# EAGLE design #1_routed_1register (EAGLE 9.6.2)
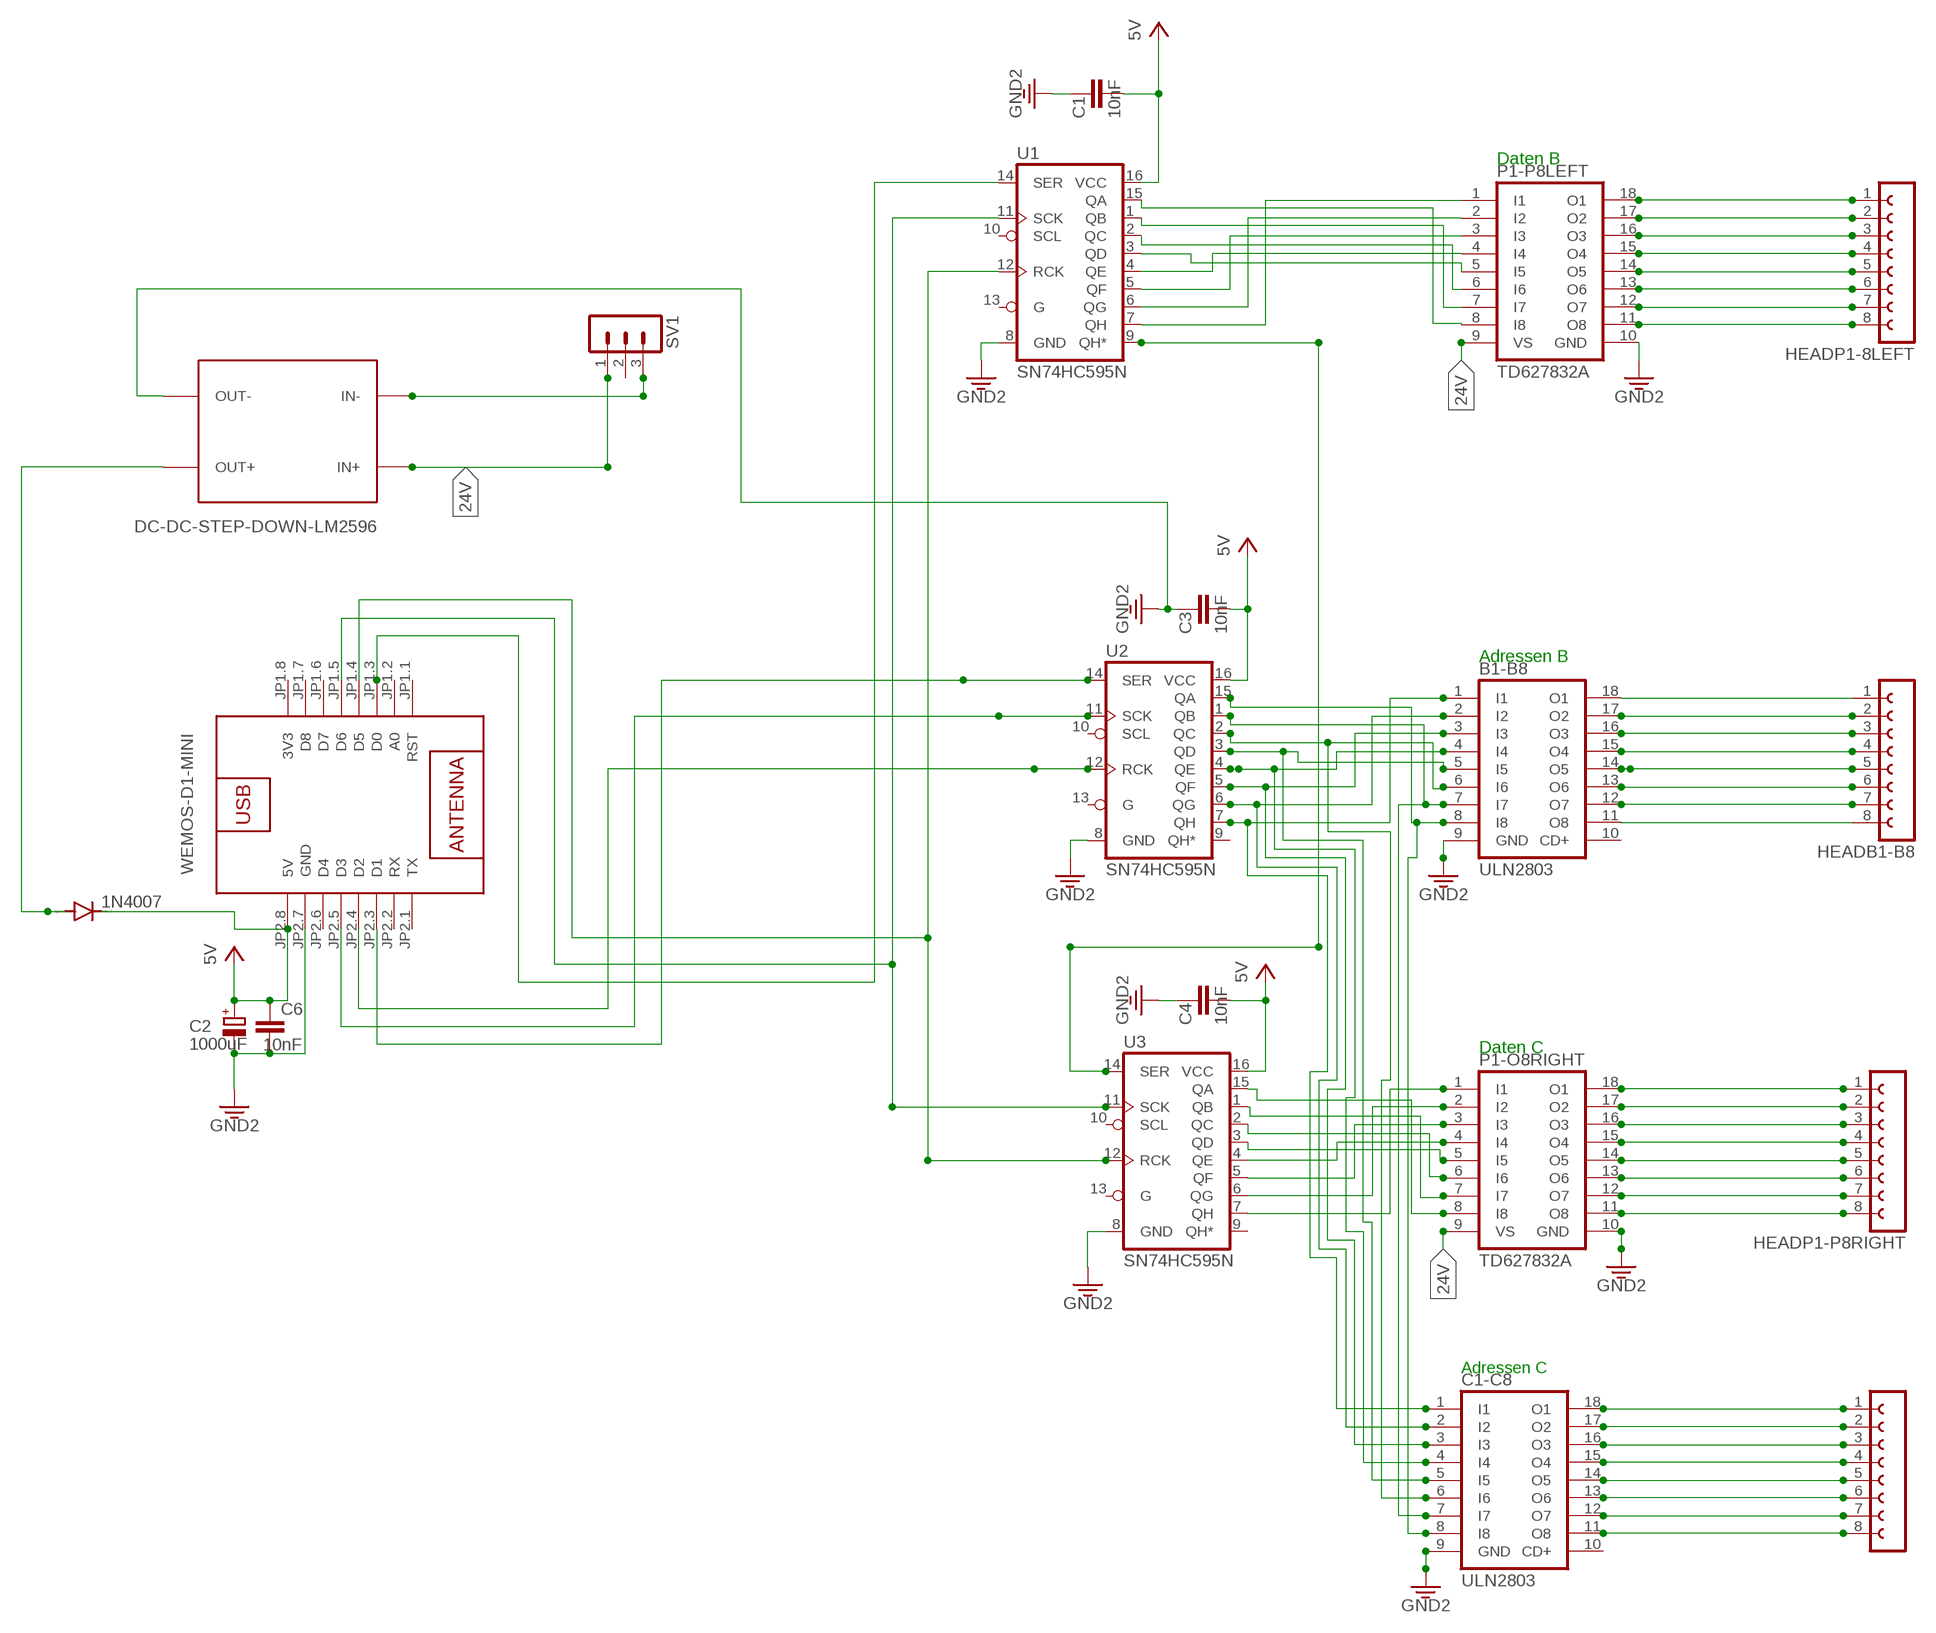
[diagram p0: schematic, sheet 1]

## Parts
1N4007  DIODE-D-2.5  [D-2.5]
B1-B8  ULN2803  ULN2803A  [DIL18]
C1  10nF  C-EU025-025X050  [C025-025X050]
C1-C8  ULN2803  ULN2803A  [DIL18]
C2  1000uF  CPOL-EUE5-10.5  [E5-10,5]
C3  10nF  C-EU025-025X050  [C025-025X050]
C4  10nF  C-EU025-025X050  [C025-025X050]
C6  10nF  C-EU025-025X050  [C025-025X050]
HEADB1-B8  FE08-1  [FE08]
HEADC1-C8  FE08-1  [FE08]
HEADP1-8LEFT  FE08-1  [FE08]
HEADP1-P8RIGHT  FE08-1  [FE08]
P1-O8RIGHT  TD627832A  [DIL18]
P1-P8LEFT  TD627832A  [DIL18]
SV1  MA03-1  [MA03-1]
U1  SN74HC595N  74HC595N  [DIP16]
U2  SN74HC595N  74HC595N  [DIP16]
U3  SN74HC595N  74HC595N  [DIP16]
U$1  WEMOS-D1-MINI  [WEMOS-D1-MINI]
U$2  DC-DC-STEP-DOWN-LM2596  [DC-DC-STEP-DOWN-LM2596]

## Nets
24V: P1-O8RIGHT.9(VS) P1-P8LEFT.9(VS) SV1.1 U$2.IN+
GND: B1-B8.9(GND) C1-C8.9(GND) C1.1 C2.- C3.1 C4.1 C6.2 P1-O8RIGHT.10(GND) P1-P8LEFT.10(GND) U1.8(GND) U2.8(GND) U3.8(GND) U$1.JP2.7(GND) U$2.OUT- ; supply symbol labelled GND2
N$1: B1-B8.7(I7) C1-C8.7(I7) U2.1(QB)
N$2: B1-B8.2(I2) C1-C8.2(I2) U2.6(QG)
N$3: B1-B8.3(I3) C1-C8.3(I3) U2.5(QF)
N$4: B1-B8.4(I4) C1-C8.4(I4) U2.4(QE)
N$5: B1-B8.5(I5) C1-C8.5(I5) U2.3(QD)
N$6: B1-B8.6(I6) C1-C8.6(I6) U2.2(QC)
N$7: B1-B8.1(I1) C1-C8.1(I1) U2.7(QH)
N$8: B1-B8.8(I8) C1-C8.8(I8) U2.15(QA)
N$9: HEADP1-8LEFT.2 P1-P8LEFT.17(O2)
N$10: HEADP1-8LEFT.3 P1-P8LEFT.16(O3)
N$11: HEADP1-8LEFT.4 P1-P8LEFT.15(O4)
N$12: HEADP1-8LEFT.5 P1-P8LEFT.14(O5)
N$13: HEADP1-8LEFT.6 P1-P8LEFT.13(O6)
N$14: HEADP1-8LEFT.7 P1-P8LEFT.12(O7)
N$15: HEADP1-8LEFT.8 P1-P8LEFT.11(O8)
N$16: B1-B8.18(O1) HEADB1-B8.1
N$17: B1-B8.17(O2) HEADB1-B8.2
N$18: B1-B8.16(O3) HEADB1-B8.3
N$19: B1-B8.15(O4) HEADB1-B8.4
N$20: HEADP1-8LEFT.1 P1-P8LEFT.18(O1)
N$21: B1-B8.14(O5) HEADB1-B8.5
N$22: B1-B8.13(O6) HEADB1-B8.6
N$23: B1-B8.12(O7) HEADB1-B8.7
N$24: B1-B8.11(O8) HEADB1-B8.8
N$25: P1-P8LEFT.1(I1) U1.7(QH)
N$26: HEADP1-P8RIGHT.1 P1-O8RIGHT.18(O1)
N$27: P1-P8LEFT.2(I2) U1.6(QG)
N$28: HEADP1-P8RIGHT.3 P1-O8RIGHT.16(O3)
N$29: P1-P8LEFT.3(I3) U1.5(QF)
N$30: HEADP1-P8RIGHT.2 P1-O8RIGHT.17(O2)
N$31: P1-P8LEFT.4(I4) U1.4(QE)
N$32: P1-P8LEFT.5(I5) U1.3(QD)
N$33: HEADP1-P8RIGHT.5 P1-O8RIGHT.14(O5)
N$34: U1.14(SER) U$1.JP1.3(D0)
N$35: HEADP1-P8RIGHT.6 P1-O8RIGHT.13(O6)
N$37: U2.14(SER) U$1.JP2.3(D1)
N$39: HEADP1-P8RIGHT.4 P1-O8RIGHT.15(O4)
N$40: HEADP1-P8RIGHT.7 P1-O8RIGHT.12(O7)
N$41: P1-P8LEFT.6(I6) U1.2(QC)
N$42: P1-P8LEFT.7(I7) U1.1(QB)
N$43: P1-P8LEFT.8(I8) U1.15(QA)
N$44: P1-O8RIGHT.2(I2) U3.6(QG)
N$45: P1-O8RIGHT.3(I3) U3.5(QF)
N$46: P1-O8RIGHT.4(I4) U3.4(QE)
N$47: P1-O8RIGHT.5(I5) U3.3(QD)
N$48: P1-O8RIGHT.6(I6) U3.2(QC)
N$49: HEADP1-P8RIGHT.8 P1-O8RIGHT.11(O8)
N$50: C1-C8.18(O1) HEADC1-C8.1
N$51: C1-C8.17(O2) HEADC1-C8.2
N$52: C1-C8.16(O3) HEADC1-C8.3
N$53: C1-C8.15(O4) HEADC1-C8.4
N$54: C1-C8.14(O5) HEADC1-C8.5
N$55: P1-O8RIGHT.7(I7) U3.1(QB)
N$56: P1-O8RIGHT.8(I8) U3.15(QA)
N$57: C1-C8.13(O6) HEADC1-C8.6
N$58: C1-C8.12(O7) HEADC1-C8.7
N$59: C1-C8.11(O8) HEADC1-C8.8
N$60: U2.12(RCK) U$1.JP2.4(D2)
N$61: SV1.3 U$2.IN-
N$69: 1N4007.A U$2.OUT+
N$72: P1-O8RIGHT.1(I1) U3.7(QH)
N$74: U1.12(RCK) U3.12(RCK) U$1.JP1.4(D5)
N$76: U1.11(SCK) U3.11(SCK) U$1.JP1.5(D6)
N$80: U2.11(SCK) U$1.JP2.5(D3)
N$92: U1.9(QH*) U3.14(SER)
VCC: 1N4007.C C1.2 C2.+ C3.2 C4.2 C6.1 U1.16(VCC) U2.16(VCC) U3.16(VCC) U$1.JP2.8(5V) ; supply symbol labelled 5V
Unconnected: B1-B8.10(CD+) C1-C8.10(CD+) SV1.2 U1.10(SCL) U1.13(G) U2.9(QH*) U2.10(SCL) U2.13(G) U3.9(QH*) U3.10(SCL) U3.13(G) U$1.JP1.1(RST) U$1.JP1.2(A0) U$1.JP1.6(D7) U$1.JP1.7(D8) U$1.JP2.1(TX) U$1.JP2.2(RX) U$1.JP2.6(D4)

## Notes on the sheet
- Daten B
- Adressen B
- Daten C
- Adressen C

## Power pins joined to a net without a drawn wire
3V3: U$1.JP1.8(3V3)

## Library data of the parts
1N4007 = diode:DIODE-: DIODE
B1-B8 C1-C8 = uln-udn:ULN2803A: DRIVER ARRAY
C1 C3 C4 C6 = resistor:C-EU: CAPACITOR, European symbol
C2 = resistor:CPOL-EU: POLARIZED CAPACITOR, European symbol
HEADB1-B8 HEADC1-C8 HEADP1-8LEFT HEADP1-P8RIGHT = con-lsta:FE08-1: FEMALE HEADER; OC_FARNELL: unknown; OC_NEWARK: unknown
P1-O8RIGHT P1-P8LEFT = td62083-dil:TD62783: DRIVER ARRAY Source: Allegro Microsystems Inc. / UDN2981-UDN2984.pdf
SV1 = con-lstb:MA03-1: PIN HEADER; OC_FARNELL: unknown; OC_NEWARK: unknown
U1-U3 = SparkFun-IC-Logic:74*595: 8-Bit Shift Register (Serial to Parallel) Datasheet <http://cdn.sparkfun.com/datasheets/BreakoutBoards/MM74HC595.pdf> SparkFun Products SparkFun Shift Register Breakout - 74HC595 <https://www.sparkfun.com/products/10680> (BOB-10680); PROD_ID: IC-13123
U$1 = diy-modules:WEMOS-D1-MINI: WEMOS D1 mini: Mini Wi-Fi Board based on ESP-8266 device More details can be found here: https://www.wemos.cc/product/d1-mini.html Click here to find device on ebay.com <http://www.ebay.com/sch/wemos+d1+mini+nodemcu>
U$2 = diy-modules_lm2596:DC-DC-STEP-DOWN-LM2596: DC/DC Step-Down Regulator based on LM2596-ADJ chip LM2596 datasheet available here: http://www.ti.com/lit/ds/symlink/lm2596.pdf Click here to find device on ebay.com <http://www.ebay.com/sch/lm2596+power+regulator>

## Board
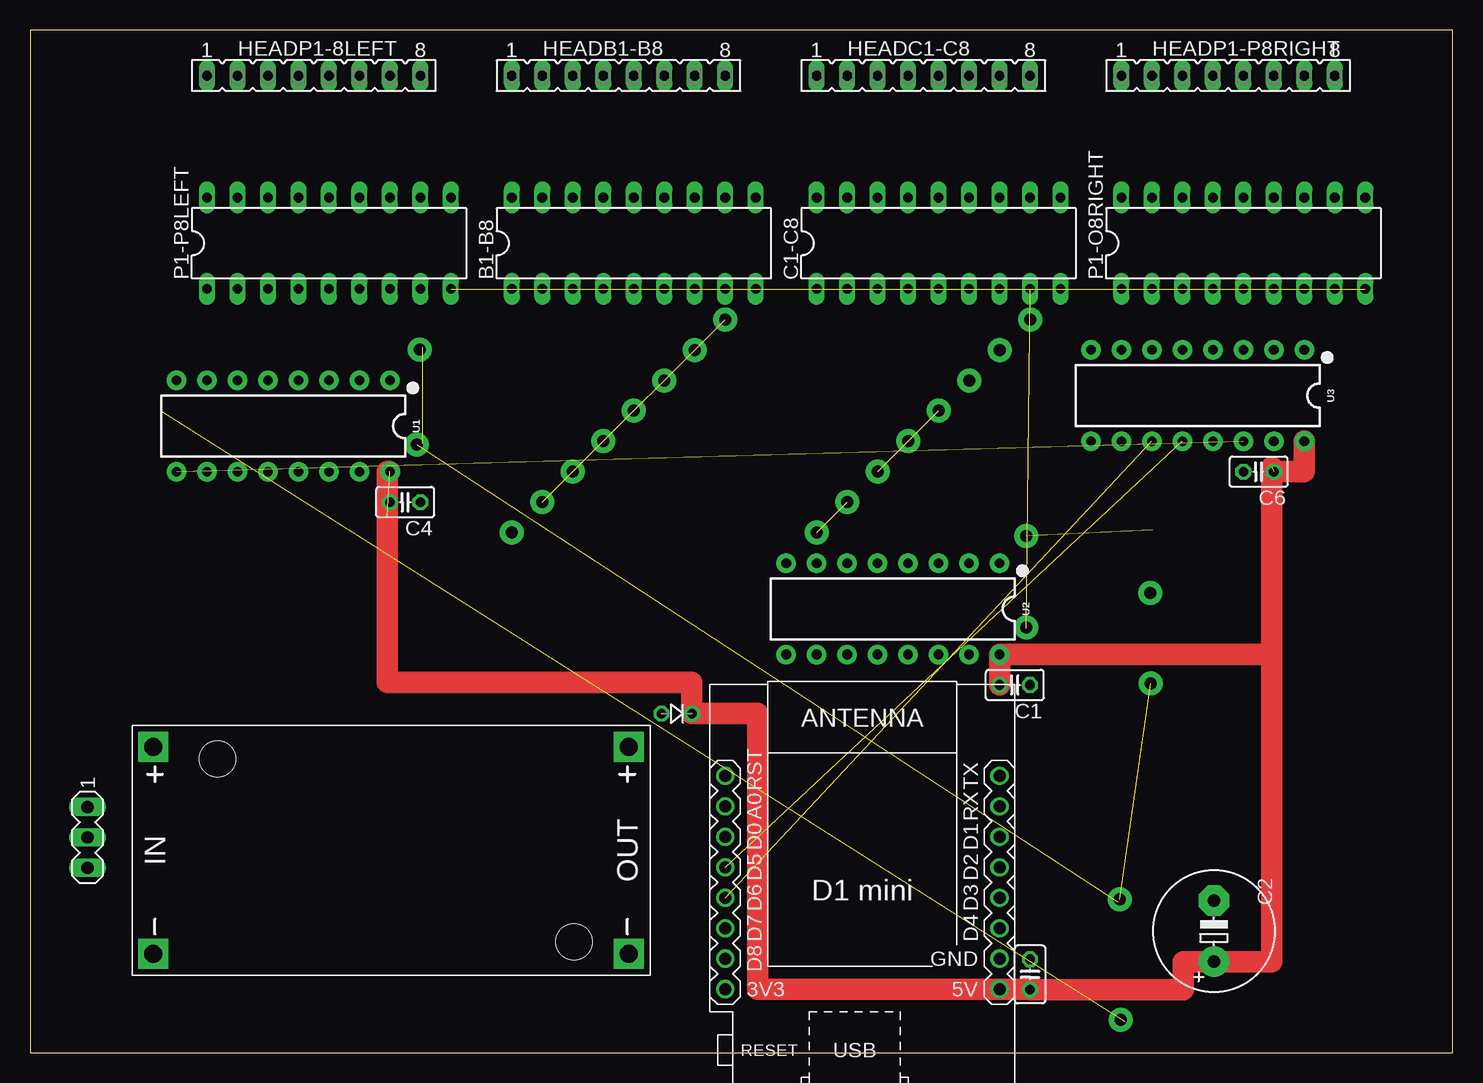
[diagram p1: board, top side]
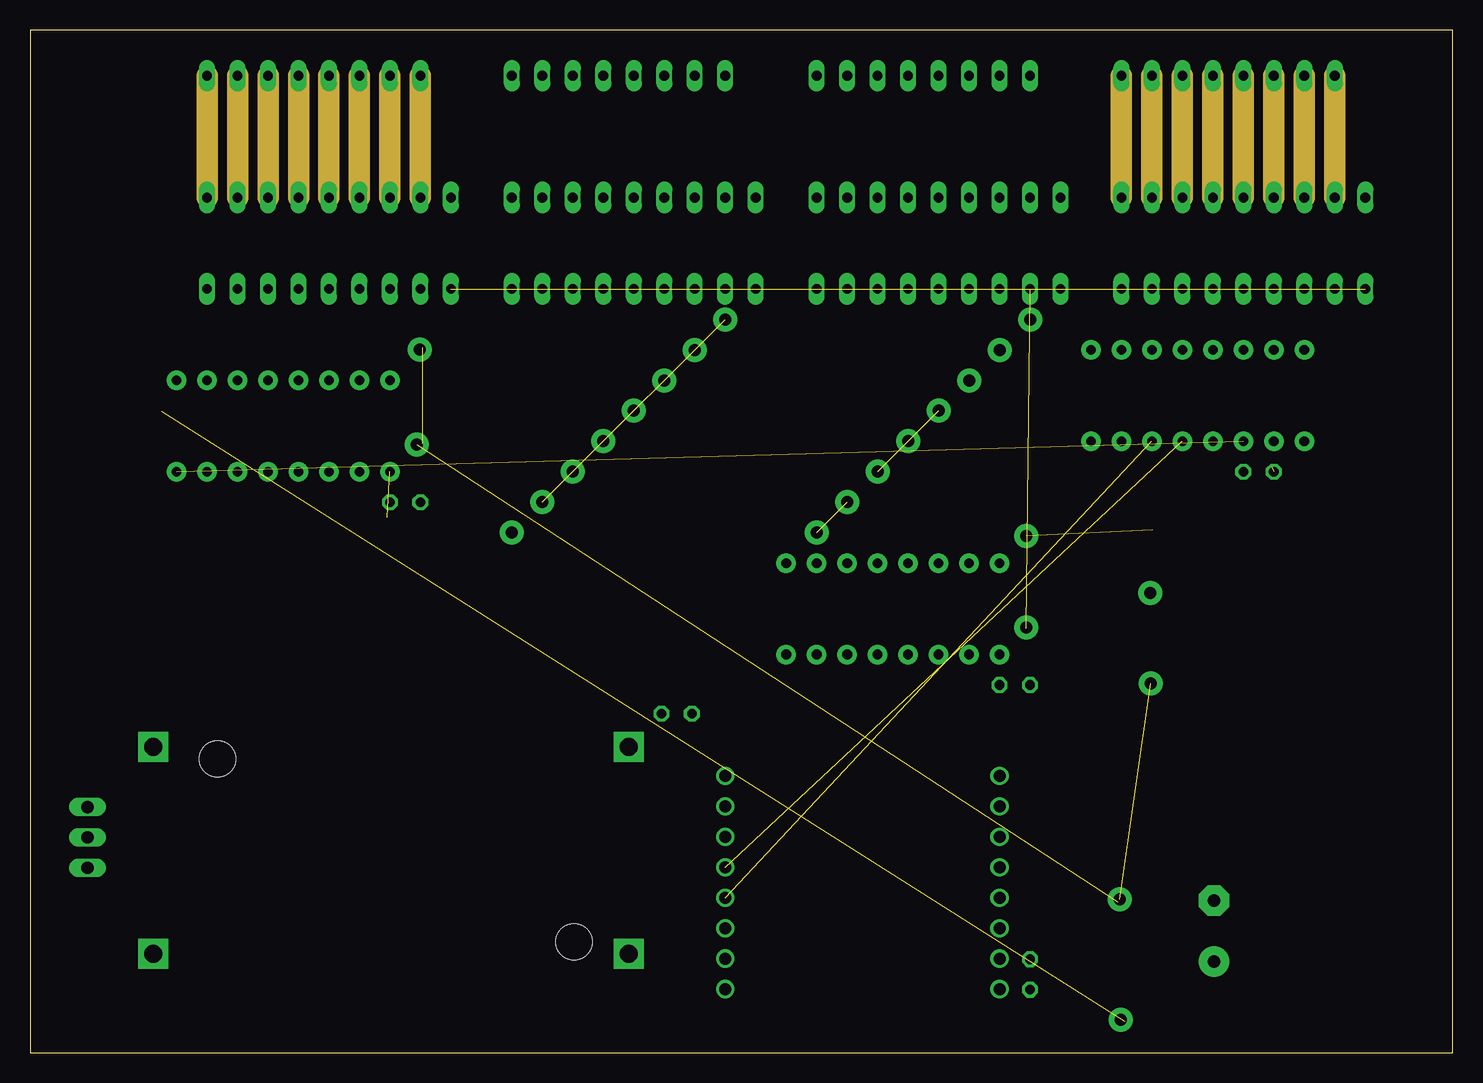
[diagram p2: board, inner layer Data]
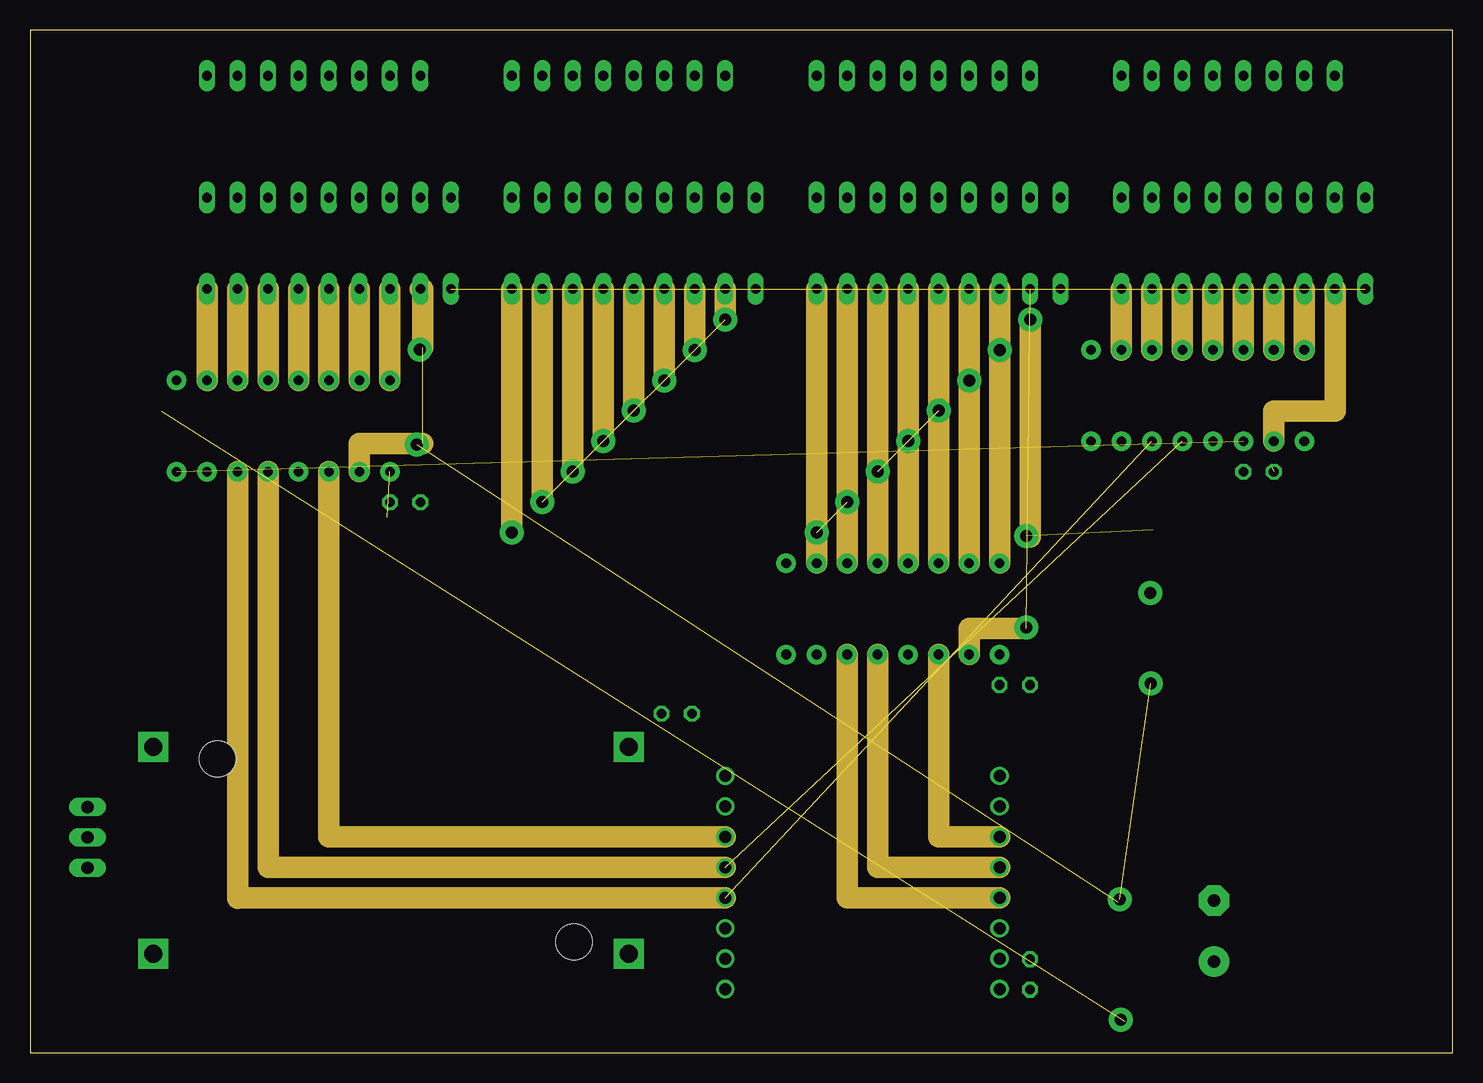
[diagram p3: board, inner layer Logic]
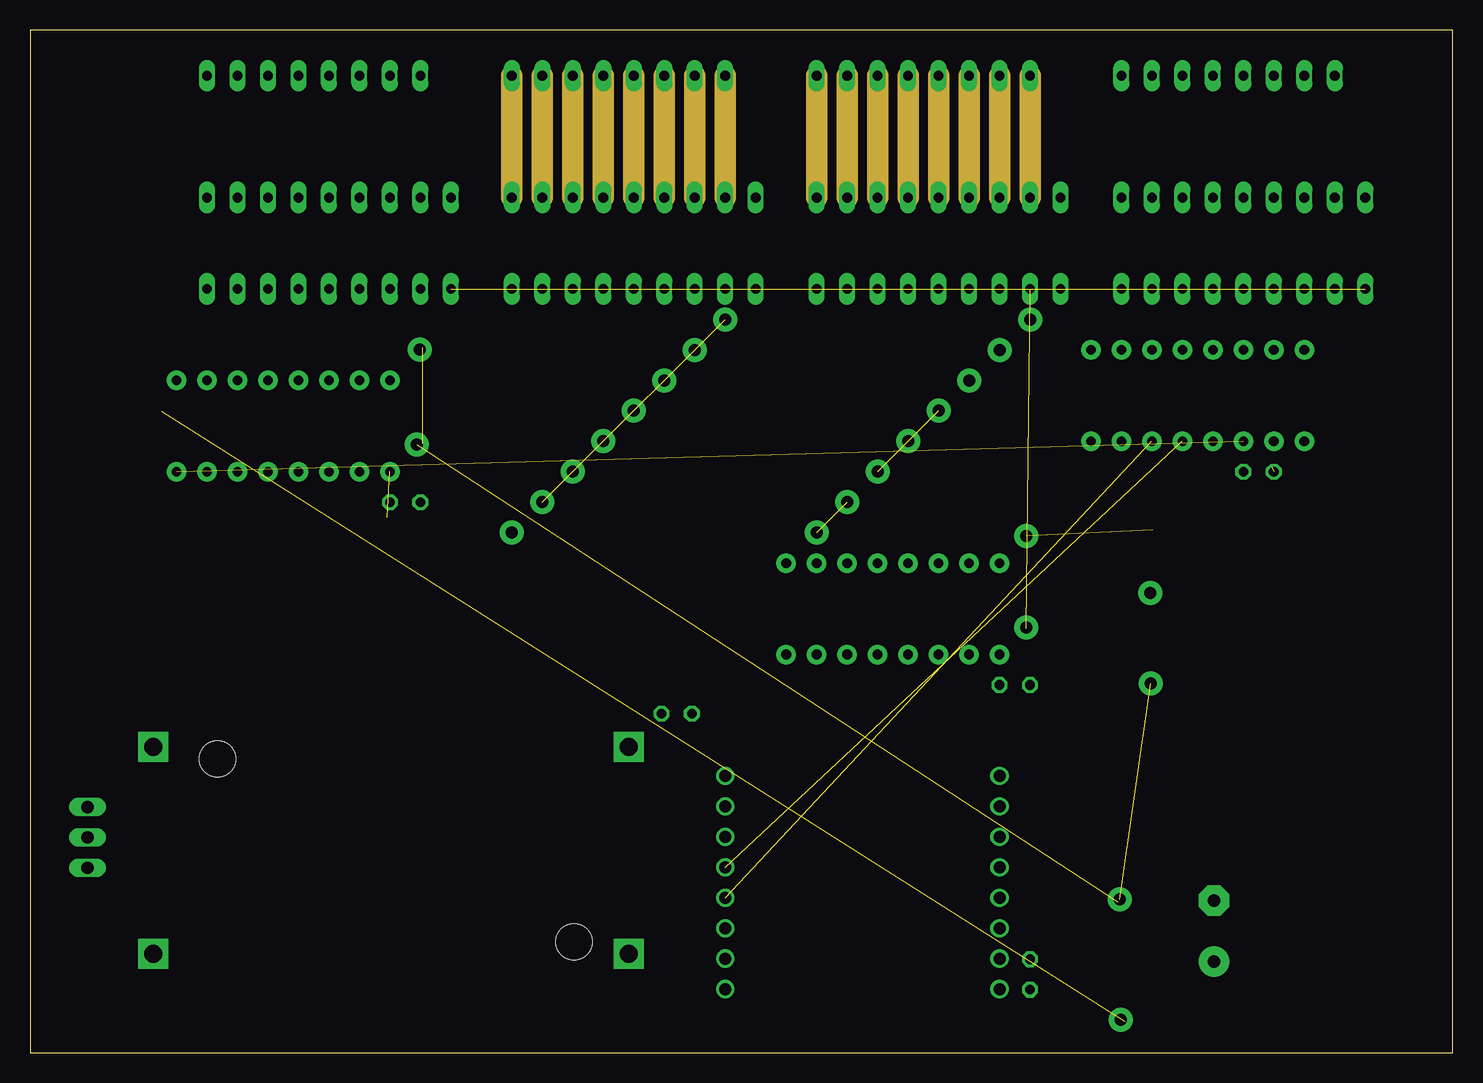
[diagram p4: board, inner layer Adress]
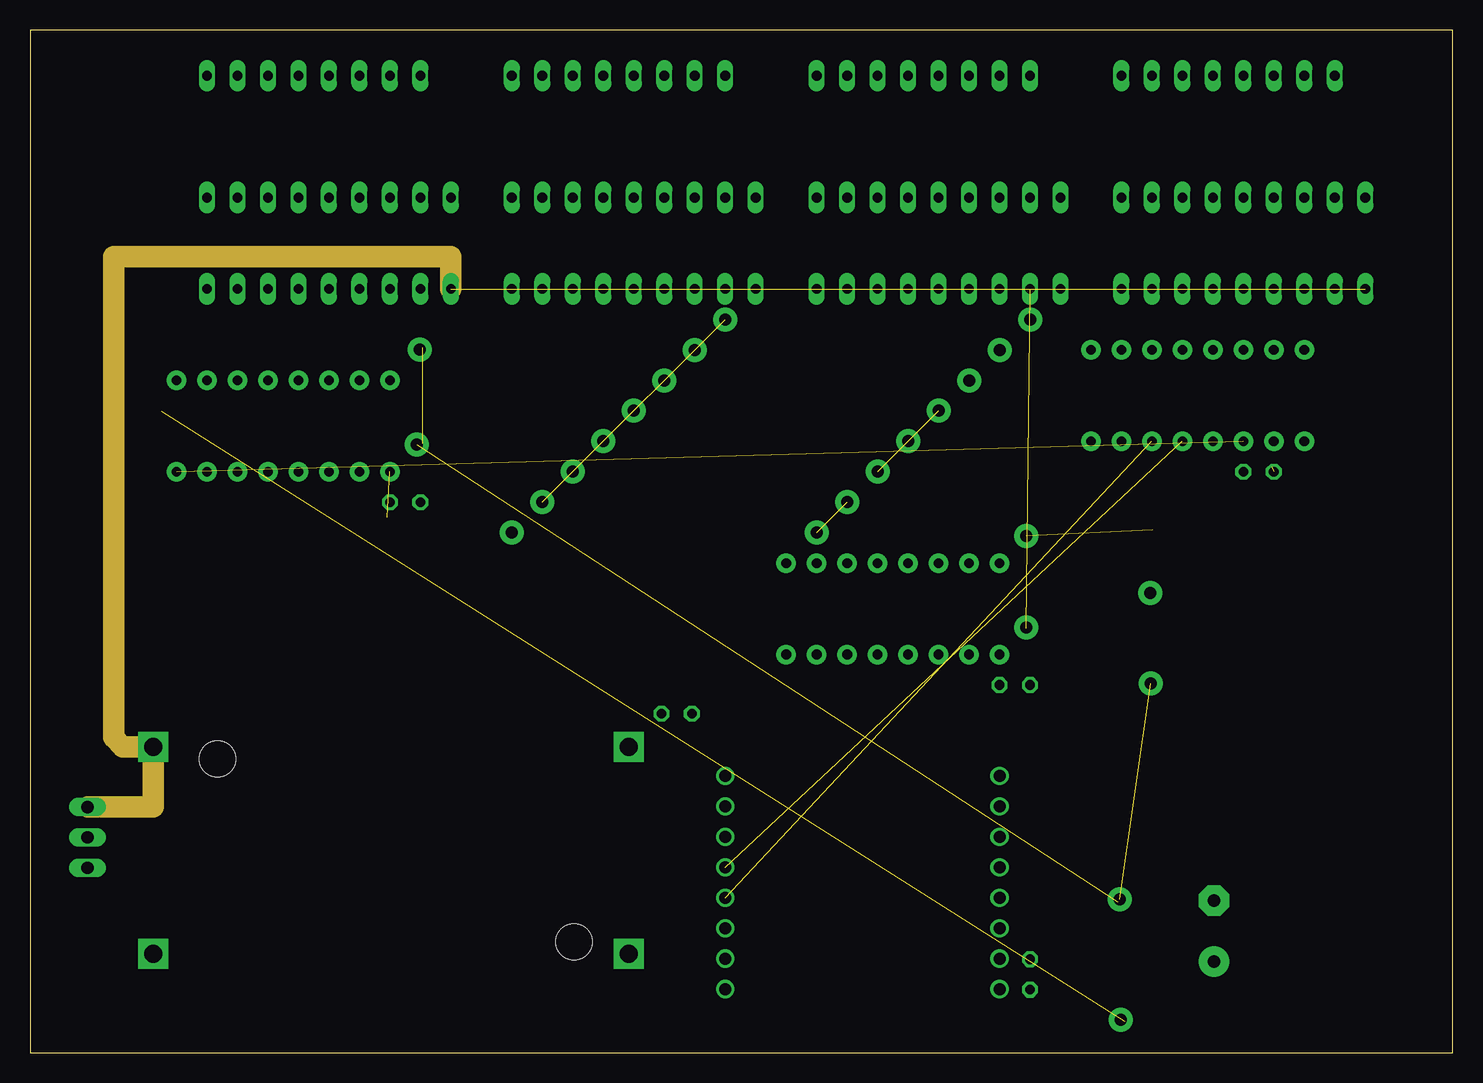
[diagram p5: board, inner layer 18V]
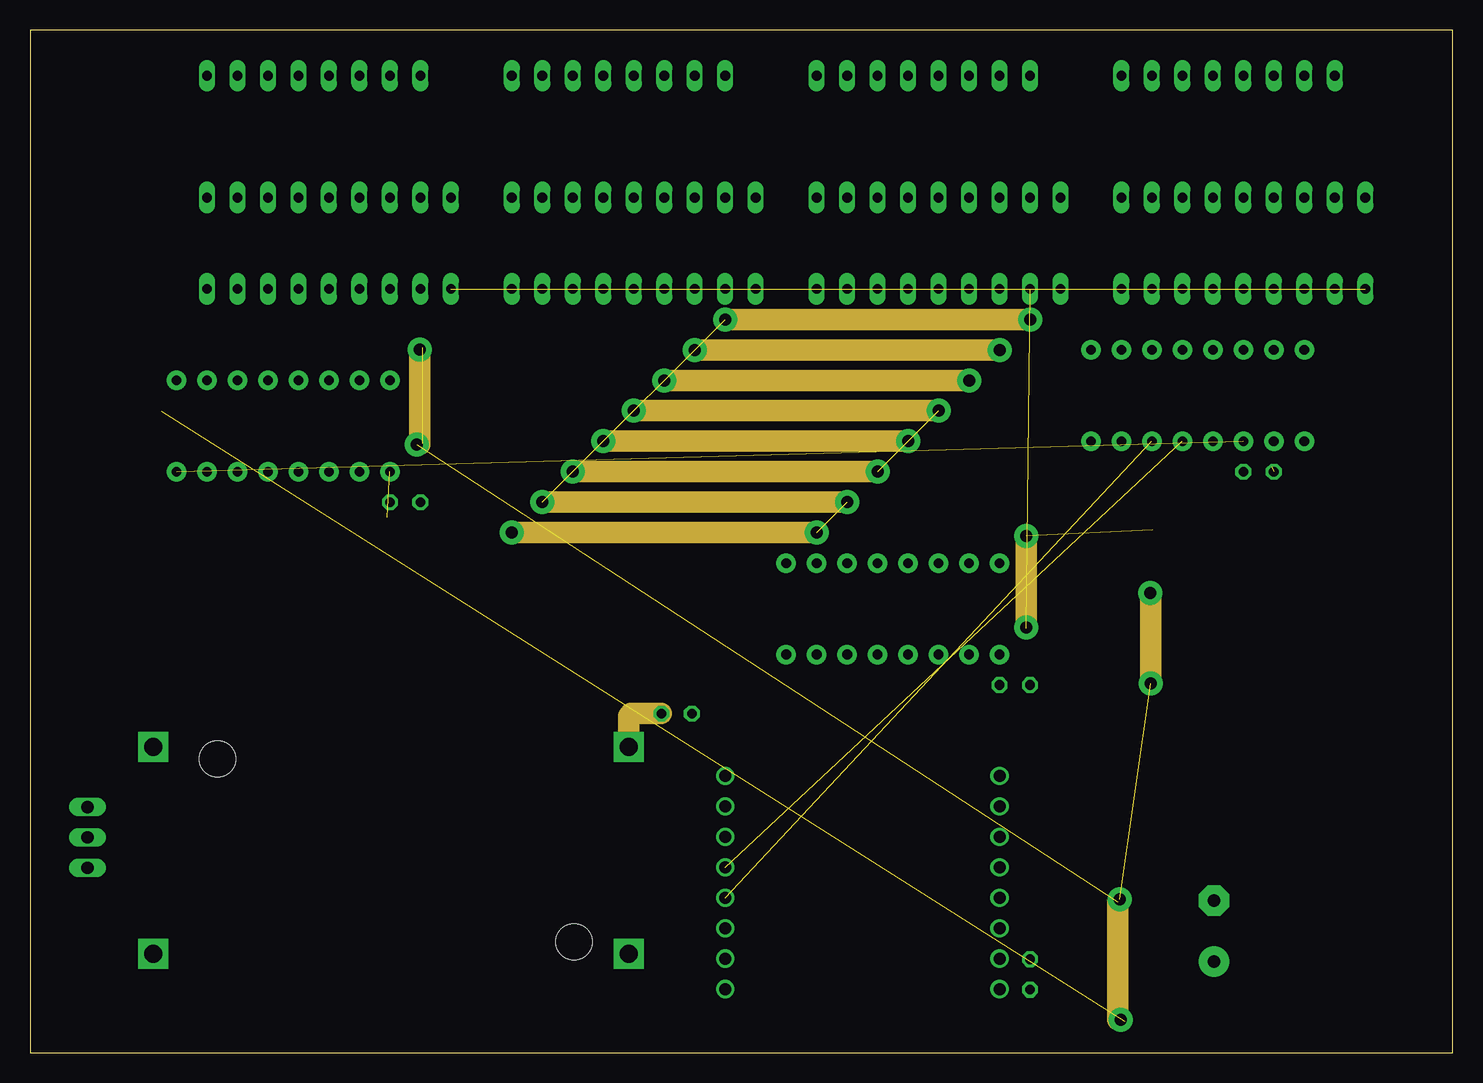
[diagram p6: board, inner layer Cable]
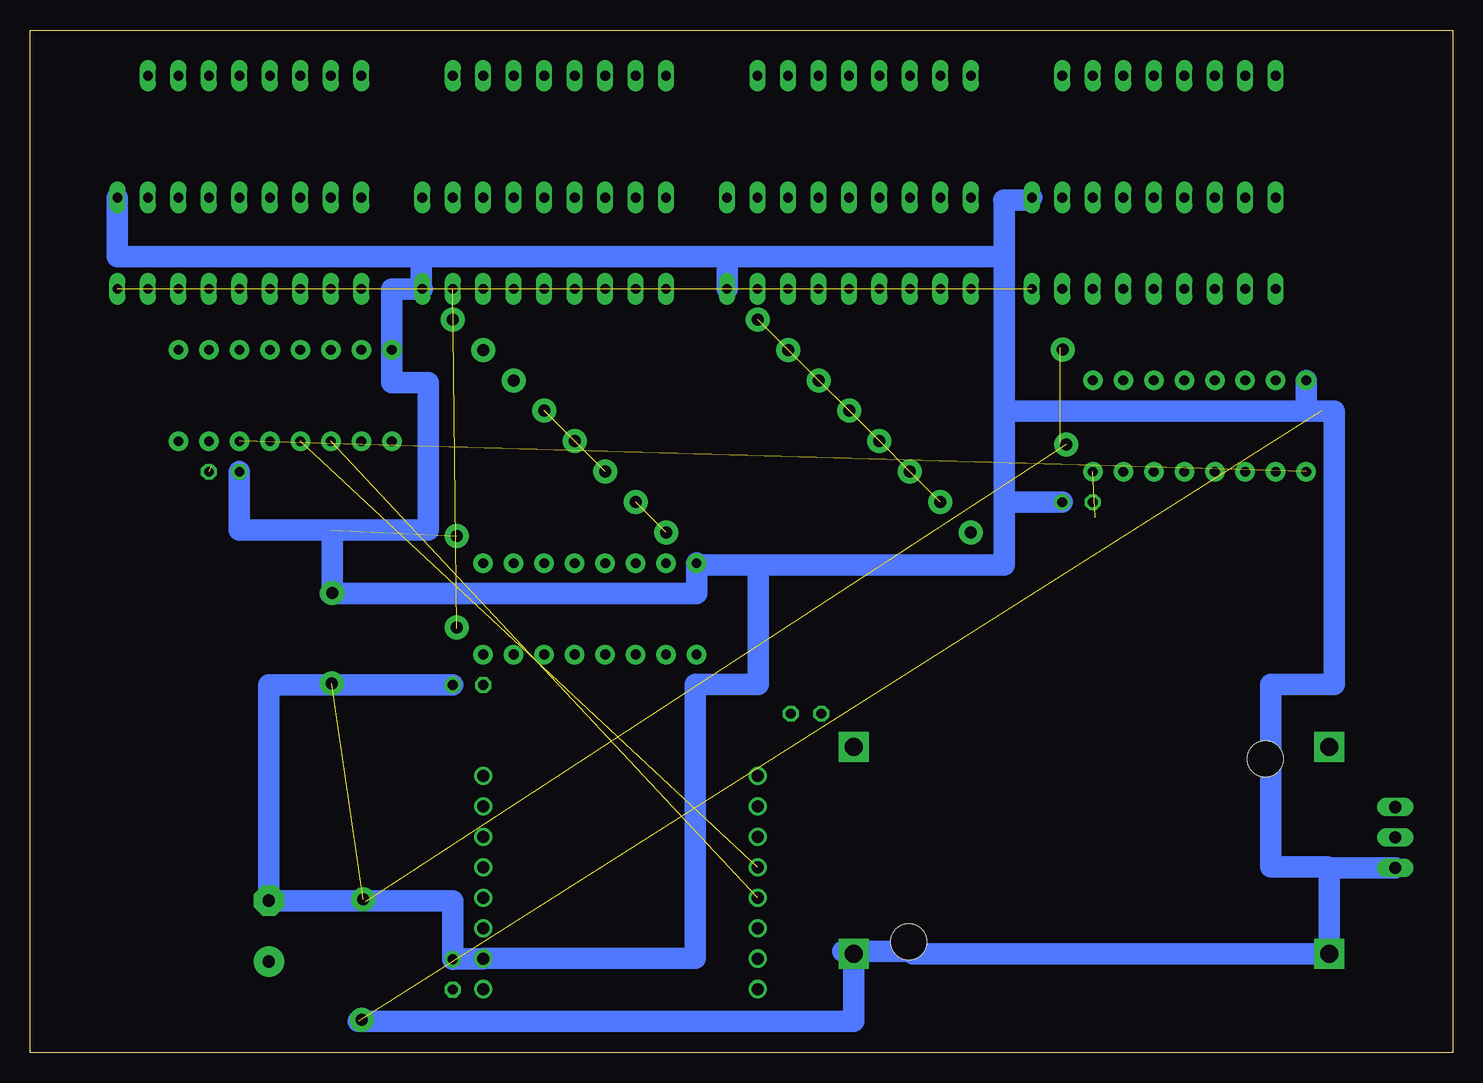
[diagram p7: board, bottom side, seen from below]

Size 118.56 x 85.27 mm. Coordinates in mm from the lower left corner, seen from the top.
Outline: 0,85.27 0,0 118.56,0 118.56,85.27 0,85.27
Copper layers (1+2*3+4*13+14*15+16): 5V 0.035mm / dielectric 1.5mm / Data 0.035mm / dielectric 0.15mm / Logic 0.035mm / dielectric 0.2mm / Adress 0.035mm / dielectric 0.15mm / Route13 0.035mm / dielectric 0.2mm / 18V 0.035mm / dielectric 0.15mm / Cable 0.035mm / dielectric 0.2mm / GND 0.035mm
Design rules "default *": minimum track width 6mil, minimum drill 0.35mm, track to track 6mil, track to pad 6mil, pad to pad 6mil, via to via 6mil, smd to smd 6mil, copper to edge 40mil, drill to drill 6mil, minimum pad ring 10mil, minimum via ring 8mil, stop-mask expansion 4mil, vias tented up to drill 0mil, thermal gap 10mil

### Footprints (pad centres in the part's own frame; a part is rotated, then mirrored left to right if it is on the bottom)
D-2.5 = drill 0.813 octagon: A 1.27,0; C -1.27,0
DIL18 = drill 0.813 long: 1 -10.16,-3.81; 2 -7.62,-3.81; 3 -5.08,-3.81; 4 -2.54,-3.81; 5 0,-3.81; 6 2.54,-3.81; 7 5.08,-3.81; 8 7.62,-3.81; 9 10.16,-3.81; 10 10.16,3.81; 11 7.62,3.81; 12 5.08,3.81; 13 2.54,3.81; 14 0,3.81; 15 -2.54,3.81; 16 -5.08,3.81; 17 -7.62,3.81; 18 -10.16,3.81
C025-025X050 = drill 0.813 octagon: 1 -1.27,0; 2 1.27,0
E5-10,5 = drill 1.016 pad 2.54: + -2.54,0 | drill 1.016 pad 2.54 octagon: - 2.54,0
FE08 = drill 0.813 long: 1 -8.89,0; 2 -6.35,0; 3 -3.81,0; 4 -1.27,0; 5 1.27,0; 6 3.81,0; 7 6.35,0; 8 8.89,0
MA03-1 = drill 1.016 long: 1 -2.54,0; 2 0,0; 3 2.54,0
DIP16 = drill 0.813 pad 1.626: 1 -8.89,-3.81; 2 -6.35,-3.81; 3 -3.81,-3.81; 4 -1.27,-3.81; 5 1.27,-3.81; 6 3.81,-3.81; 7 6.35,-3.81; 8 8.89,-3.81; 9 8.89,3.81; 10 6.35,3.81; 11 3.81,3.81; 12 1.27,3.81; 13 -1.27,3.81; 14 -3.81,3.81; 15 -6.35,3.81; 16 -8.89,3.81
WEMOS-D1-MINI = drill 1: JP1.1 -11.43,9.525; JP1.2 -11.43,6.985; JP1.3 -11.43,4.445; JP1.4 -11.43,1.905; JP1.5 -11.43,-0.635; JP1.6 -11.43,-3.175; JP1.7 -11.43,-5.715; JP1.8 -11.43,-8.255; JP2.1 11.43,9.525; JP2.2 11.43,6.985; JP2.3 11.43,4.445; JP2.4 11.43,1.905; JP2.5 11.43,-0.635; JP2.6 11.43,-3.175; JP2.7 11.43,-5.715; JP2.8 11.43,-8.255
DC-DC-STEP-DOWN-LM2596 = drill 1.5 pad 2.5 square: IN+ -19.812,8.636; IN- -19.812,-8.636; OUT+ 19.812,8.636; OUT- 19.812,-8.636 | hole 3: -14.478,7.62; 15.24,-7.62

### Placement (x,y rotation side)
1N4007  53.89,28.27 180 top
B1-B8  50.31,67.49 0 top
C1  82.06,30.66 180 top
C1-C8  75.72,67.49 0 top
C2  98.66,10.14 90 top
C3  83.34,6.53 270 top
C4  31.27,45.9 180 top
C6  102.39,48.44 180 top
HEADB1-B8  49.05,81.46 0 top
HEADC1-C8  74.45,81.46 0 top
HEADP1-8LEFT  23.65,81.46 0 top
HEADP1-P8RIGHT  99.84,81.46 0 top
P1-O8RIGHT  101.12,67.49 0 top
P1-P8LEFT  24.91,67.49 0 top
SV1  4.8,17.95 270 top
U1  21.11,52.25 180 top
U2  71.91,37.01 180 top
U3  97.31,54.79 180 top
U$1  69.36,13.56 0 top
U$2  30.09,16.88 0 top

### Tracks (layer width: path | path; a pad name or v marks a point on that pad's centre or on a via)
24V  (1 unrouted)
  18V 1.8: SV1.1 10.28,20.48 U$2.IN+ 7.74,25.51 6.97,26.28 6.97,66.39 35.08,66.39 P1-P8LEFT.9
GND  (1 unrouted)
  GND 1.8: P1-P8LEFT.10 35.31,71.06 37.39,71.06 | 37.41,71.06 37.39,71.06 | 37.39,66.39 60.48,66.39 | B1-B8.9 60.48,66.39 | 60.48,66.39 85.94,66.39 | 85.94,66.39 85.94,63.68 C1-C8.9 88.42,63.68 U3.8 88.42,55.86 85.36,55.86 85.36,43.57 101.12,43.57 C6.2 | P1-O8RIGHT.10 111.28,66.39 85.94,66.39 | C1.1 98.66,30.66 C2.- 83.34,12.68 C3.1 83.34,7.85 U$1.JP2.7 80.8,7.88 63.13,7.88 63.13,30.7 57.87,30.7 57.87,40.65 | 37.39,53.52 37.39,66.39 | 37.39,66.39 37.39,71.06 | 12.22,53.52 37.39,53.52 | U1.8 12.22,53.52 | 93.55,38.3 63.02,38.3 U2.8 63.02,40.65 57.87,40.65 | 37.39,53.52 37.39,45.9 | 37.39,45.9 37.39,40.65 57.87,40.65 | C4.1 37.39,45.9 | 12.22,53.52 10.95,53.52 9.9,53.52 9.9,30.7 15.16,30.7 15.16,15.49 10.48,15.49 | U$2.OUT- 49.91,2.62 91.21,2.62
N$1  (via drill 1 pad 2)  (1 unrouted)
  Logic 1.8: U2.1 v80.8,58.6 C1-C8.7 | B1-B8.7 55.39,58.6
  Cable 1.8: v80.8,58.6 55.39,58.6
N$2  (1 unrouted)
  Logic 1.8: U2.6 C1-C8.2 | B1-B8.2 42.7,45.9
N$3  (1 unrouted)
  Logic 1.8: U2.5 C1-C8.3 | B1-B8.3 45.23,48.44
N$4  (1 unrouted)
  Logic 1.8: U2.4 C1-C8.4 | B1-B8.4 47.78,50.98
N$5  (1 unrouted)
  Logic 1.8: U2.3 C1-C8.5 | B1-B8.5 50.31,53.52
N$6  (via drill 1 pad 2)  (1 unrouted)
  Logic 1.8: U2.2 v78.25,56.06 C1-C8.6 | B1-B8.6 52.86,56.06
  Cable 1.8: v78.25,56.06 52.86,56.06
N$7  (1 unrouted)
  Logic 1.8: U2.7 C1-C8.1 | B1-B8.1 40.16,43.36
N$8  (2 unrouted)
  Logic 1.8: U2.15 78.25,35.38 83.02,35.38
N$9
  Data 1.8: P1-P8LEFT.17 HEADP1-8LEFT.2
N$10
  Data 1.8: P1-P8LEFT.16 HEADP1-8LEFT.3
N$11
  Data 1.8: P1-P8LEFT.15 HEADP1-8LEFT.4
N$12
  Data 1.8: P1-P8LEFT.14 HEADP1-8LEFT.5
N$13
  Data 1.8: P1-P8LEFT.13 HEADP1-8LEFT.6
N$14
  Data 1.8: HEADP1-8LEFT.7 P1-P8LEFT.12
N$15
  Data 1.8: P1-P8LEFT.11 HEADP1-8LEFT.8
N$16
  Adress 1.8: B1-B8.18 HEADB1-B8.1
N$17
  Adress 1.8: B1-B8.17 HEADB1-B8.2
N$18
  Adress 1.8: B1-B8.16 HEADB1-B8.3
N$19
  Adress 1.8: B1-B8.15 HEADB1-B8.4
N$20
  Data 1.8: P1-P8LEFT.18 HEADP1-8LEFT.1
N$21
  Adress 1.8: B1-B8.14 HEADB1-B8.5
N$22
  Adress 1.8: B1-B8.13 HEADB1-B8.6
N$23
  Adress 1.8: B1-B8.12 HEADB1-B8.7
N$24
  Adress 1.8: B1-B8.11 HEADB1-B8.8
N$25
  Logic 1.8: P1-P8LEFT.1 U1.7
N$26
  Data 1.8: P1-O8RIGHT.18 HEADP1-P8RIGHT.1
N$27
  Logic 1.8: U1.6 P1-P8LEFT.2
N$28
  Data 1.8: P1-O8RIGHT.16 HEADP1-P8RIGHT.3
N$29
  Logic 1.8: P1-P8LEFT.3 U1.5
N$30
  Data 1.8: P1-O8RIGHT.17 HEADP1-P8RIGHT.2
N$31
  Logic 1.8: P1-P8LEFT.4 U1.4
N$32
  Logic 1.8: U1.3 P1-P8LEFT.5
N$33
  Data 1.8: P1-O8RIGHT.14 HEADP1-P8RIGHT.5
N$34
  Logic 1.8: U1.14 24.91,18.01 U$1.JP1.3
N$35
  Data 1.8: P1-O8RIGHT.13 HEADP1-P8RIGHT.6
N$36  (via drill 1 pad 2)  (2 unrouted)
  Cable 1.8: v93.42,30.77 93.42,38.32 v93.37,38.32
  GND 1.8: v93.37,38.32 93.37,43.57 93.55,43.57
  other vias: 83.02,43.09 90.8,12.79
N$37
  Logic 1.8: U2.14 75.72,18.01 U$1.JP2.3
N$38  (via drill 1 pad 2)
  Cable 1.8: v83.02,35.47 83.02,42.98
N$39
  Data 1.8: P1-O8RIGHT.15 HEADP1-P8RIGHT.4
N$40
  Data 1.8: P1-O8RIGHT.12 HEADP1-P8RIGHT.7
N$41
  Logic 1.8: U1.2 P1-P8LEFT.6
N$42
  Logic 1.8: U1.1 P1-P8LEFT.7
N$43  (1 unrouted)
  Logic 1.8: U1.15 27.45,50.78 32.71,50.78 | P1-P8LEFT.8 32.71,63.68 32.71,58.78
N$44
  Logic 1.8: U3.6 P1-O8RIGHT.2
N$45
  Logic 1.8: P1-O8RIGHT.3 U3.5
N$46
  Logic 1.8: P1-O8RIGHT.4 U3.4
N$47
  Logic 1.8: P1-O8RIGHT.5 U3.3
N$48
  Logic 1.8: P1-O8RIGHT.6 U3.2
N$49
  Data 1.8: P1-O8RIGHT.11 HEADP1-P8RIGHT.8
N$50
  Adress 1.8: C1-C8.18 HEADC1-C8.1
N$51
  Adress 1.8: C1-C8.17 HEADC1-C8.2
N$52
  Adress 1.8: C1-C8.16 HEADC1-C8.3
N$53
  Adress 1.8: C1-C8.15 HEADC1-C8.4
N$54
  Adress 1.8: C1-C8.14 HEADC1-C8.5
N$55
  Logic 1.8: P1-O8RIGHT.7 U3.1
N$56
  Logic 1.8: U3.15 103.66,53.52 108.76,53.52 108.76,63.68 P1-O8RIGHT.8
N$57
  Adress 1.8: C1-C8.13 HEADC1-C8.6
N$58
  Adress 1.8: C1-C8.12 HEADC1-C8.7
N$59
  Adress 1.8: C1-C8.11 HEADC1-C8.8
N$60
  Logic 1.8: U$1.JP2.4 70.64,15.47 U2.12
N$61
  GND 1.8: SV1.3 10.28,15.4 U$2.IN- 45,8.24 45.23,8.47 50.84,8.47
N$62  (via drill 1 pad 2)
  other vias: 55.39,58.6
N$63  (via drill 1 pad 2)  (4 unrouted)
  Logic 1.8: v57.94,61.14 57.94,63.68 | v83.34,61.14 83.34,42.98 83.02,42.98
  Cable 1.8: v83.34,61.14 v57.94,61.14 | v75.72,53.52 50.31,53.52 | v73.17,50.98 47.78,50.98 | v70.64,48.44 45.23,48.44
  other vias: 52.86,56.06
N$64  (via drill 1 pad 2)  (2 unrouted)
  Cable 1.8: v68.09,45.9 42.7,45.9 | v65.56,43.36 40.16,43.36
  other vias: 50.31,53.52
N$65  (via drill 1 pad 2)
  other vias: 47.78,50.98
N$66  (via drill 1 pad 2)
  other vias: 45.23,48.44
N$67  (via drill 1 pad 2)
  other vias: 42.7,45.9
N$68  (via drill 1 pad 2)
  other vias: 40.16,43.36
N$69
  Cable 1.8: 1N4007.A 50.08,28.27 49.91,28.1 U$2.OUT+
N$70  (via drill 1 pad 2)  (1 unrouted)
  Cable 1.8: v32.5,58.61 32.5,50.71 v32.22,50.71 | v90.92,2.73 90.62,2.73 90.62,12.56
N$72
  Logic 1.8: U3.7 P1-O8RIGHT.1
N$74  (1 unrouted)
  Logic 1.8: U1.12 19.84,15.47 U$1.JP1.4
N$76  (1 unrouted)
  Logic 1.8: U$1.JP1.5 17.34,12.93 17.3,12.88 U1.11
N$80
  Logic 1.8: U2.11 68.09,12.93 U$1.JP2.5
N$92  (1 unrouted)
VCC  (2 unrouted)
  5V 1.8: C1.2 U2.16 103.5,33.2 | 103.5,33.2 103.5,48.84 | U1.16 29.79,48.44 29.79,44.63 29.79,30.88 55.16,30.88 1N4007.C 60.65,28.27 60.65,5.31 U$1.JP2.8 83.34,5.31 C3.2 96.12,5.26 96.12,7.6 C2.+ 103.5,7.6 103.5,33.2 | C6.1 106.19,48.44 U3.16